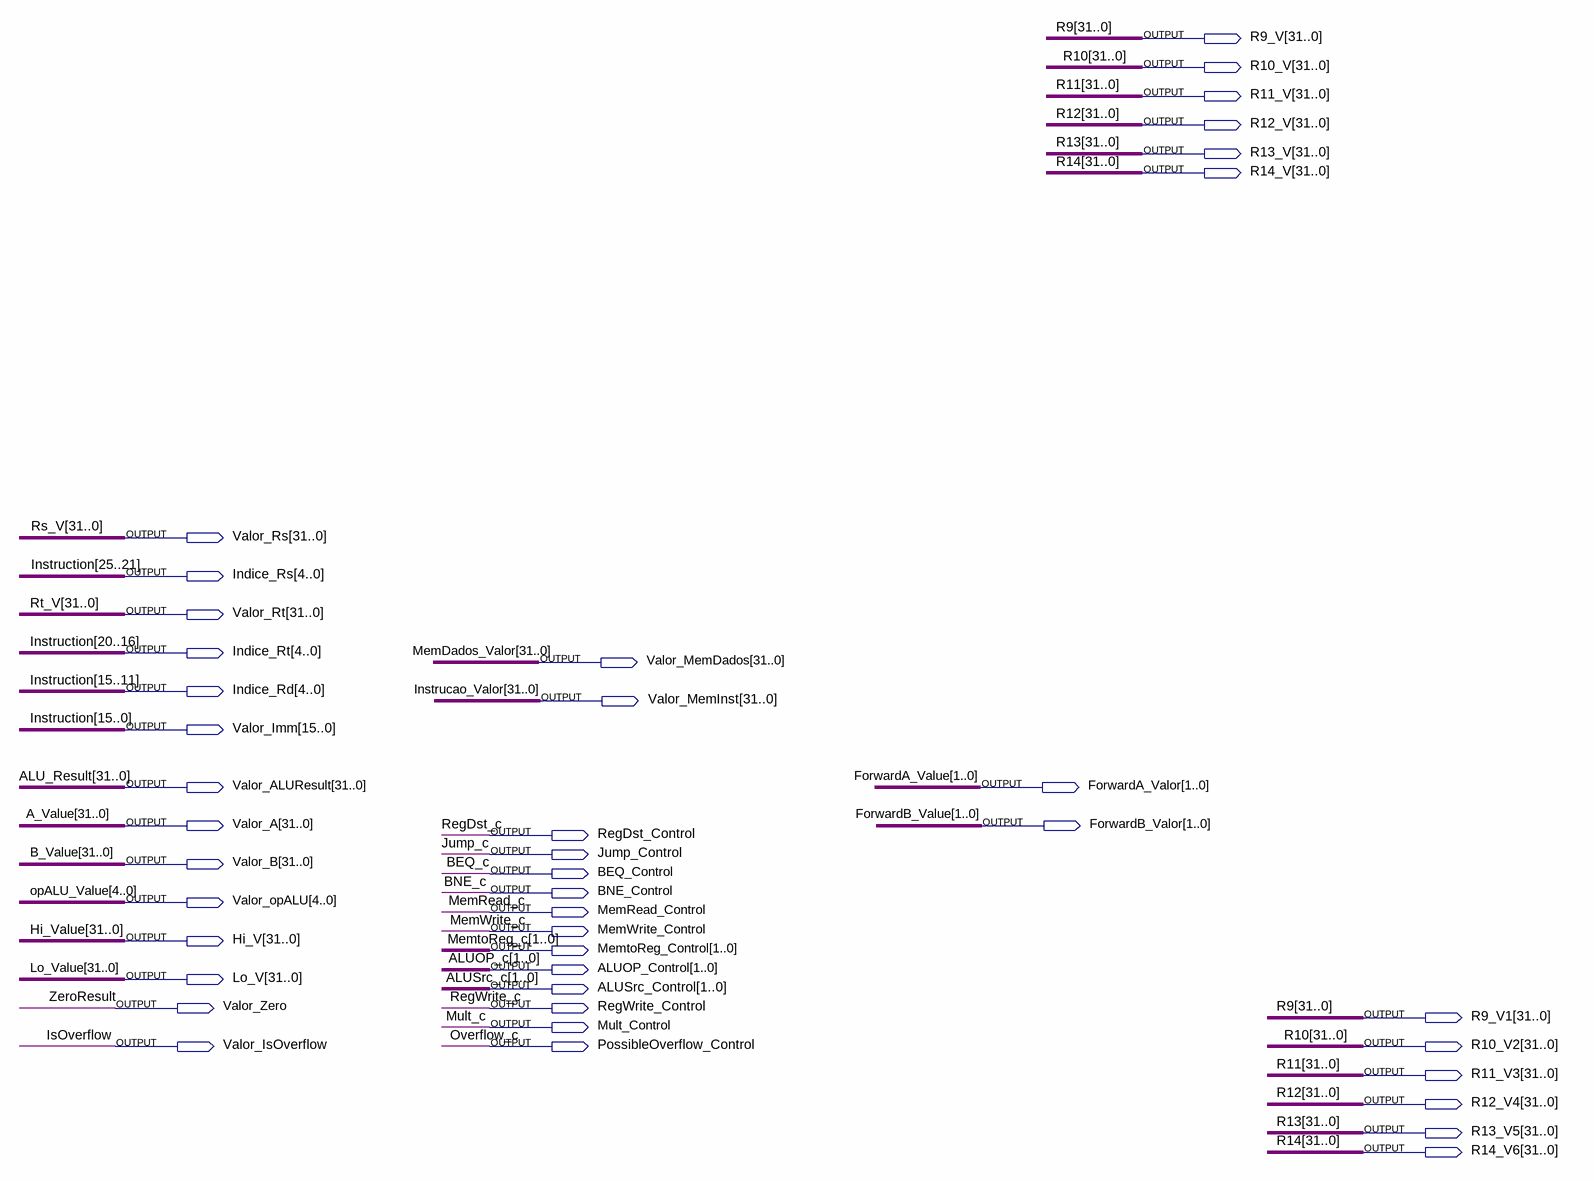
[diagram p0: schematic sheet]
// Quartus schematic Outputs.bdf as structural Verilog: 0 symbols, 42 pins
module Outputs (
  output [31:0] R9_V,
  output [31:0] R10_V,
  output [31:0] R11_V,
  output [31:0] R12_V,
  output [31:0] R13_V,
  output [31:0] R14_V,
  output [31:0] Valor_Rs,
  output [4:0] Indice_Rs,
  output [31:0] Valor_Rt,
  output [4:0] Indice_Rt,
  output [31:0] Valor_MemDados,
  output [4:0] Indice_Rd,
  output [31:0] Valor_MemInst,
  output [15:0] Valor_Imm,
  output [31:0] Valor_ALUResult,
  output [1:0] ForwardA_Valor,
  output [31:0] Valor_A,
  output [1:0] ForwardB_Valor,
  output RegDst_Control,
  output Jump_Control,
  output [31:0] Valor_B,
  output BEQ_Control,
  output BNE_Control,
  output [4:0] Valor_opALU,
  output MemRead_Control,
  output MemWrite_Control,
  output [31:0] Hi_V,
  output [1:0] MemtoReg_Control,
  output [1:0] ALUOP_Control,
  output [31:0] Lo_V,
  output [1:0] ALUSrc_Control,
  output Valor_Zero,
  output RegWrite_Control,
  output [31:0] R9_V1,
  output Mult_Control,
  output Valor_IsOverflow,
  output PossibleOverflow_Control,
  output [31:0] R10_V2,
  output [31:0] R11_V3,
  output [31:0] R12_V4,
  output [31:0] R13_V5,
  output [31:0] R14_V6
);


  assign R9_V1 = R9_V;
  assign R10_V2 = R10_V;
  assign R11_V3 = R11_V;
  assign R12_V4 = R12_V;
  assign R13_V5 = R13_V;
  assign R14_V6 = R14_V;
  assign Valor_Imm[15:11] = Indice_Rd;

  // Other names for the same wires on the sheet: A_Value[31:0] = Valor_A; ALU_Result[31:0] = Valor_ALUResult;
  //   ALUOP_c[1:0] = ALUOP_Control; ALUSrc_c[1:0] = ALUSrc_Control; B_Value[31:0] = Valor_B; BEQ_c = BEQ_Control;
  //   BNE_c = BNE_Control; ForwardA_Value[1:0] = ForwardA_Valor; ForwardB_Value[1:0] = ForwardB_Valor;
  //   Hi_Value[31:0] = Hi_V; Instrucao_Valor[31:0] = Valor_MemInst;
  //   Instruction[25:0] = {Indice_Rs, Indice_Rt, Indice_Rd, Valor_Imm[10:0]}; IsOverflow = Valor_IsOverflow;
  //   Jump_c = Jump_Control; Lo_Value[31:0] = Lo_V; MemDados_Valor[31:0] = Valor_MemDados;
  //   MemRead_c = MemRead_Control; MemtoReg_c[1:0] = MemtoReg_Control; MemWrite_c = MemWrite_Control;
  //   Mult_c = Mult_Control; opALU_Value[4:0] = Valor_opALU; Overflow_c = PossibleOverflow_Control; R9[31:0] = R9_V;
  //   R10[31:0] = R10_V; R11[31:0] = R11_V; R12[31:0] = R12_V; R13[31:0] = R13_V; R14[31:0] = R14_V;
  //   RegDst_c = RegDst_Control; RegWrite_c = RegWrite_Control; Rs_V[31:0] = Valor_Rs; Rt_V[31:0] = Valor_Rt;
  //   ZeroResult = Valor_Zero
endmodule
